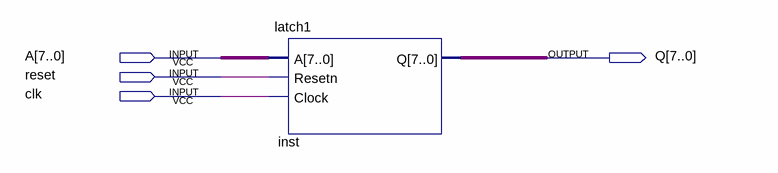
[diagram p0: schematic sheet]
// Quartus schematic latch1block.bdf as structural Verilog: 1 symbols, 4 pins
module latch1block (
  input  [7:0] A,
  input  reset,
  input  clk,
  output [7:0] Q
);

  latch1 inst (.A(A), .Resetn(reset), .Clock(clk), .Q(Q));
endmodule
